# Altium project EEE3061WDesignProject_PowerBoard.PrjPcb
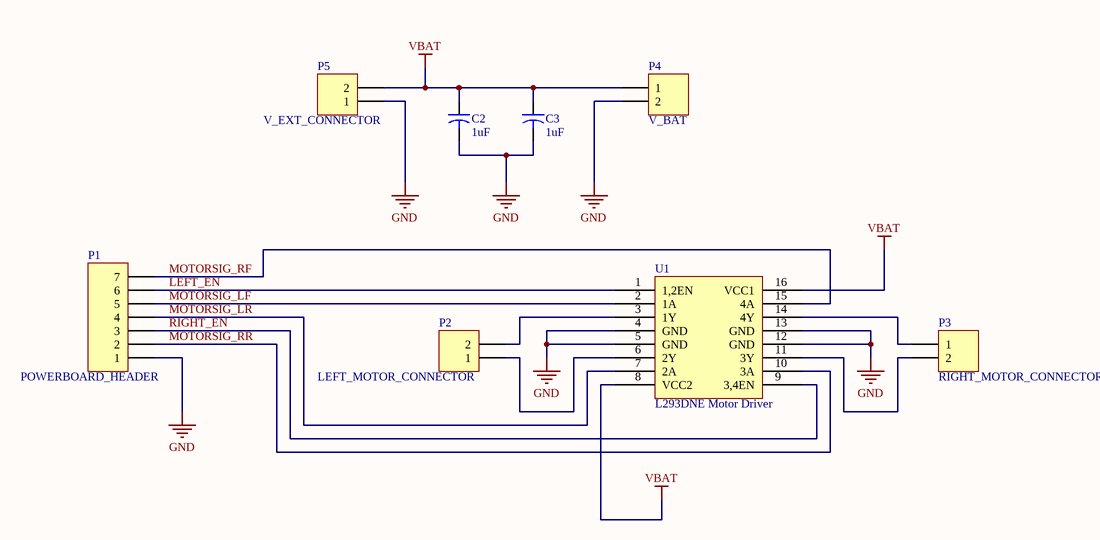
[diagram p0: PowerBoardSchematic.SchDoc]
1 sheet, 8 parts. Net scope: global (net labels, ports and power ports of the same name join across sheets).
Board file: PowerBoardPCBRev1.PcbDoc

## Sheet PowerBoardSchematic.SchDoc: EEE3061W Design Project - Power Board
size A4; DrawnBy: Team 13; DocumentNumber: 2; Revision: 0; PageSetup: Record=PageOptions|CenterHorizontal=True|CenterVertical=True|PrintScale=1.00|XCorrection=1.00|YCorrection=1.00|PrintKind=1|BorderSize=5000000|LeftOffset=0|BottomOffset=0|Orientation=2|PaperLength=1000|PaperWidth=1000|Scale=100|PaperSource=7|PrintQuality=-3|MediaType=1|DitherType=10|PrintScaleMode=1|PaperKind=A5|PaperIndex=11

### Parts
C2  1uF  [CAPR5-4X5]
C3  1uF  [CAPR5-4X5]
P1  POWERBOARD_HEADER  [HDR1X7]
P2  LEFT_MOTOR_CONNECTOR  [HDR1X2]
P3  RIGHT_MOTOR_CONNECTOR  [HDR1X2]
P4  V_BAT  [HDR1X2]
P5  V_EXT_CONNECTOR  [HDR1X2]
U1  L293DNE Motor Driver  [DIP16 (NE)]

### Nets
GND: C2.2 C3.2 P1.1 P4.2 P5.1 U1.4(GND) U1.5(GND) U1.12(GND) U1.13(GND)
VBAT: C2.1 C3.1 P4.1 P5.2 U1.8(VCC2) U1.16(VCC1)
LEFT_EN: P1.6 U1.1(1,2EN)
MOTORSIG_LF: P1.5 U1.2(1A)
MOTORSIG_LR: P1.4 U1.7(2A)
MOTORSIG_RF: P1.7 U1.15(4A)
MOTORSIG_RR: P1.2 U1.10(3A)
RIGHT_EN: P1.3 U1.9(3,4EN)
NetP2_1: P2.1 U1.6(2Y)
NetP2_2: P2.2 U1.3(1Y)
NetP3_1: P3.1 U1.14(4Y)
NetP3_2: P3.2 U1.11(3Y)

### Library data of the parts
C2 C3 = Cap2: Capacitor; Published: 23-Sep-2002; PackageReference: CAPR5-4X5; Publisher: Altium Limited; PackageDescription: Capacitor; 2 Leads; Value: 1uF
P1 = Header 7: Header, 7-Pin; LatestRevisionDate: 17-Jul-2002; LatestRevisionNote: Re-released for DXP Platform.; Publisher: Altium Limited
P2-P5 = Header 2: Header, 2-Pin; LatestRevisionDate: 17-Jul-2002; LatestRevisionNote: Re-released for DXP Platform.; Publisher: Altium Limited
U1 = L293DNE: TI L293DNE Quad H-bridge Motor Driver